# EAGLE schematic micropet_v1 (EAGLE 6.4)

## Sheet 1 of 3: I/O
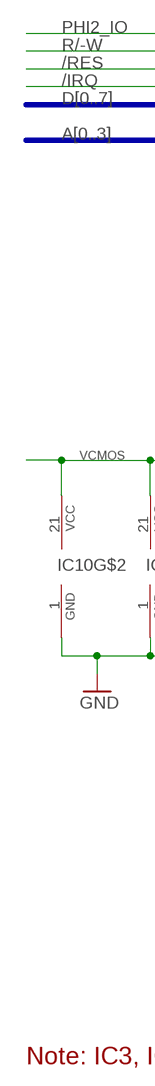
[diagram p0: schematic, sheet 1, part 1 of 2]
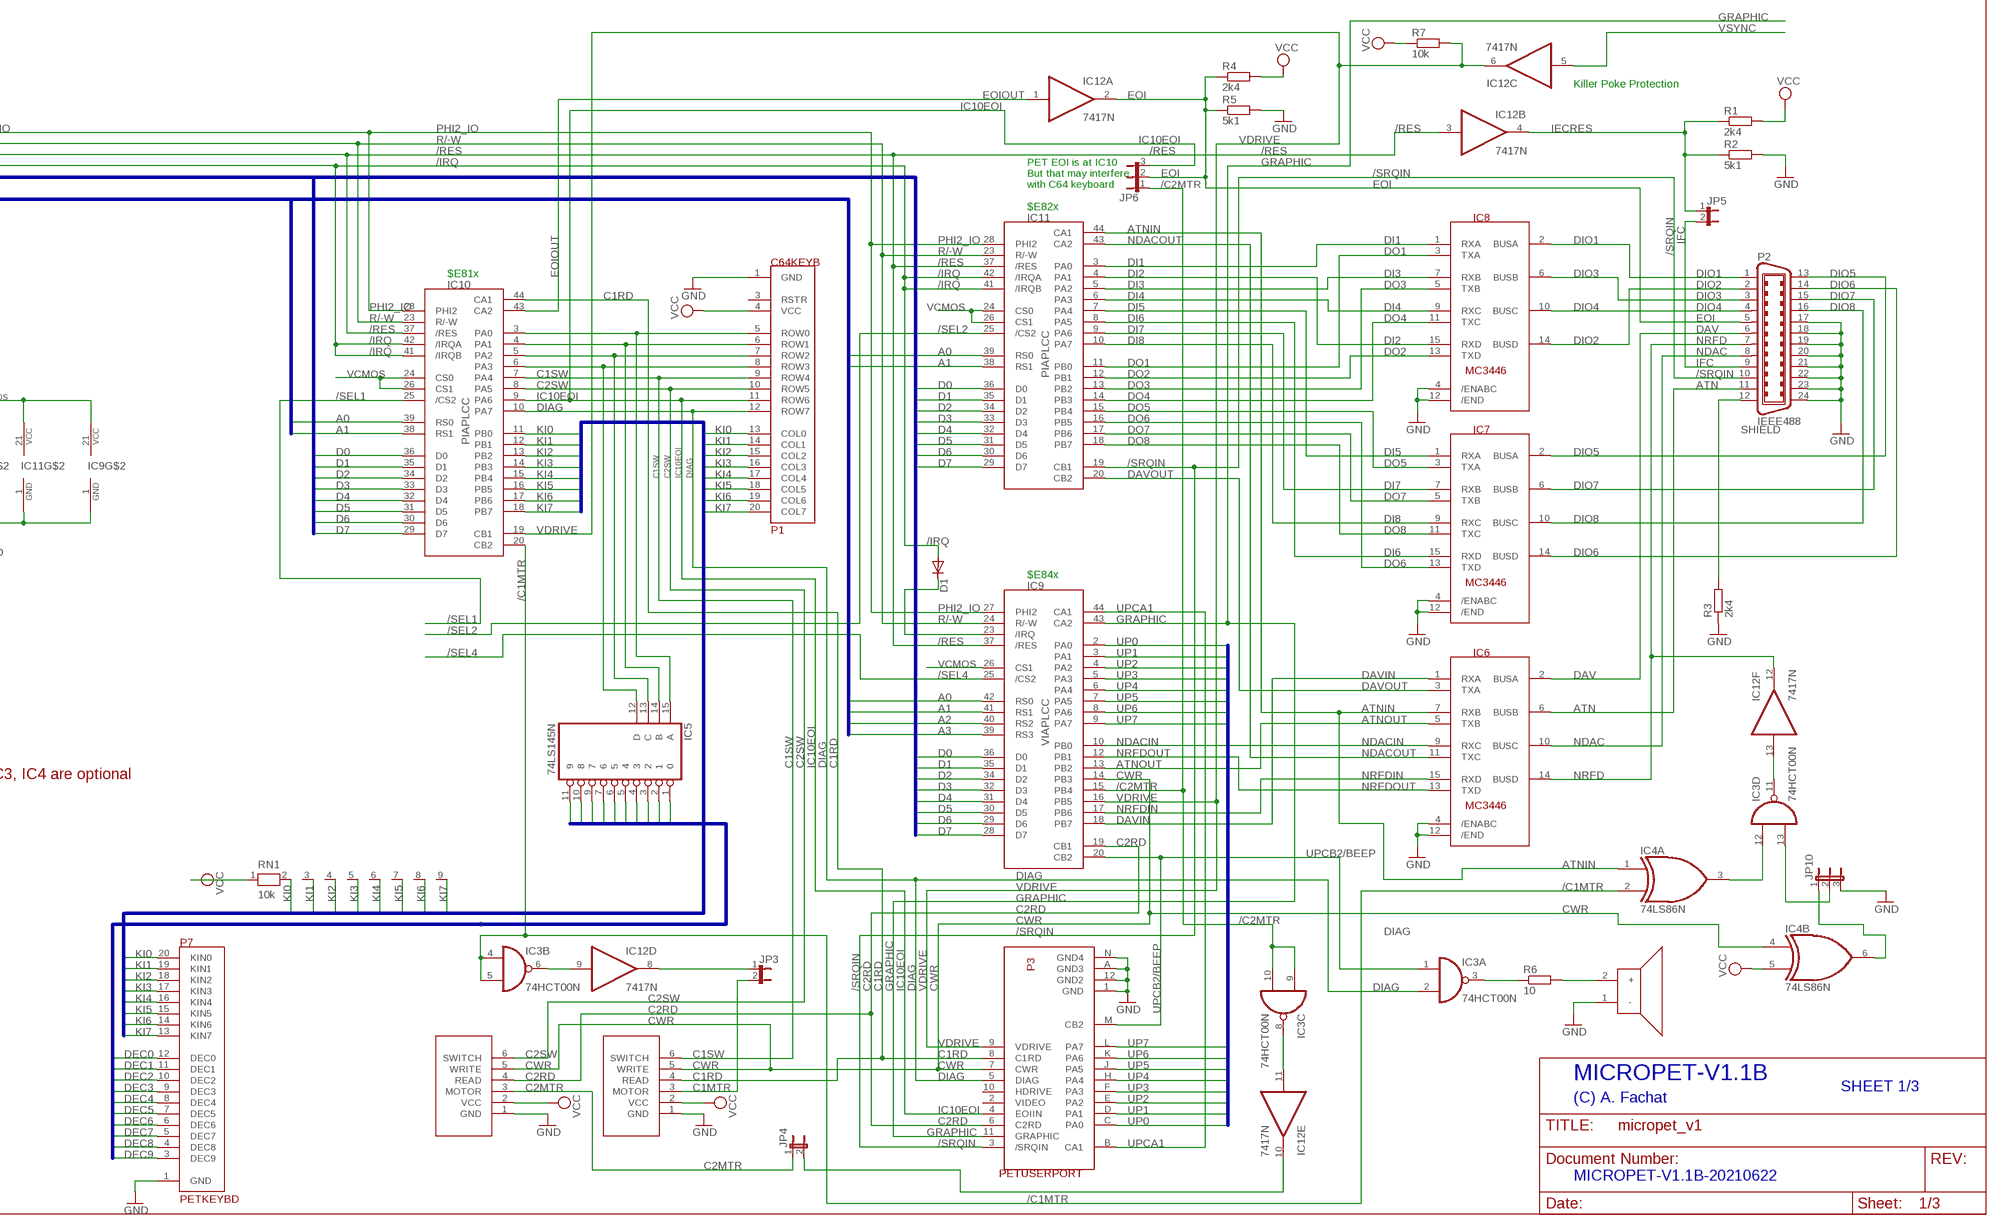
[diagram p1: schematic, sheet 1, part 2 of 2]

### Parts
BEEP1  PIEZOBEEPER  [JP2]
D1  DIODE-D-5  [D-5]
IC3  74HCT00N  [DIL14]
IC4  74LS86N  [DIL14]
IC5  74LS145N  [DIL16]
IC6  MC3446  [DIL16]
IC7  MC3446  [DIL16]
IC8  MC3446  [DIL16]
IC9  VIAPLCC  [PLCC44]
IC10  PIAPLCC  [PLCC44]
IC11  PIAPLCC  [PLCC44]
IC12  7417N  [DIL14]
JP3  JP1E  [JP1]
JP4  JP1E  [JP1]
JP5  JP1E  [JP1]
JP6  JP2E  [JP2]
JP10  JP2E  [JP2]
P1  C64KEYB  [C64KEYB]
P2  IEEE488  [24HP]
P3  PETUSERPORT  [FLAT24]
P5  CBMTAPE  [JP6]
P6  CBMTAPE  [JP6]
P7  PETKEYBD  [C64KEYB]
R1  2k4  R-EU_0207/2V  [0207/2V]
R2  5k1  R-EU_0207/2V  [0207/2V]
R3  2k4  R-EU_0207/2V  [0207/2V]
R4  2k4  R-EU_0207/10  [0207/10]
R5  5k1  R-EU_0207/2V  [0207/2V]
R6  10  R-EU_0207/2V  [0207/2V]
R7  10k  R-EU_0207/10  [0207/10]
RN1  10k  RN08  [RN-9]

### Nets
/C1MTR: IC3.4(B:I0) IC3.5(B:I1) IC4.2(A:I1) IC10.20(CB2)
/C2MTR: IC3.9(C:I0) IC3.10(C:I1) IC9.15(PB4) JP6.1
/IRQ: D1.A IC10.41(/IRQB) IC10.42(/IRQA) IC11.41(/IRQB) IC11.42(/IRQA) ; also sheet 2
/RES: IC9.37(/RES) IC10.37(/RES) IC11.37(/RES) IC12.3(B:I) ; also sheet 2,3
/SEL1: IC10.25(/CS2) ; also sheet 2
/SEL2: IC11.25(/CS2) ; also sheet 2
/SEL4: IC9.25(/CS2) ; also sheet 2
/SRQIN: IC11.19(CB1) P2.10 P3.3(/SRQIN)
A0: IC9.42(RS0) IC10.39(RS0) IC11.39(RS0) ; also sheet 2
A1: IC9.41(RS1) IC10.38(RS1) IC11.38(RS1) ; also sheet 2
A2: IC9.40(RS2) ; also sheet 2
A3: IC9.39(RS3) ; also sheet 2
ATN: IC6.6(BUSB) P2.11
ATNIN: IC4.1(A:I0) IC6.7(RXB) IC11.44(CA1)
ATNOUT: IC6.5(TXB) IC9.13(PB2)
C1MTR: JP3.2 P5.3(MOTOR)
C1RD: IC10.44(CA1) P3.8(C1RD) P5.4(READ)
C1SW: IC10.7(PA4) P1.9(ROW4) P5.6(SWITCH)
C2MTR: JP4.1 P6.3(MOTOR)
C2RD: IC9.19(CB1) P3.6(C2RD) P6.4(READ)
C2SW: IC10.8(PA5) P1.10(ROW5) P6.6(SWITCH)
CWR: IC4.4(B:I0) IC9.14(PB3) P3.7(CWR) P5.5(WRITE) P6.5(WRITE)
D0: IC9.36(D0) IC10.36(D0) IC11.36(D0) ; also sheet 2
D1: IC9.35(D1) IC10.35(D1) IC11.35(D1) ; also sheet 2
D2: IC9.34(D2) IC10.34(D2) IC11.34(D2) ; also sheet 2
D3: IC9.32(D3) IC10.33(D3) IC11.33(D3) ; also sheet 2
D4: IC9.31(D4) IC10.32(D4) IC11.32(D4) ; also sheet 2
D5: IC9.30(D5) IC10.31(D5) IC11.31(D5) ; also sheet 2
D6: IC9.29(D6) IC10.30(D6) IC11.30(D6) ; also sheet 2
D7: IC9.28(D7) IC10.29(D7) IC11.29(D7) ; also sheet 2
DAV: IC6.2(BUSA) P2.6
DAVIN: IC6.1(RXA) IC9.18(PB7)
DAVOUT: IC6.3(TXA) IC11.20(CB2)
DEC0: IC5.1 P7.12(DEC0)
DEC1: IC5.2 P7.11(DEC1)
DEC2: IC5.3 P7.10(DEC2)
DEC3: IC5.4 P7.9(DEC3)
DEC4: IC5.5 P7.8(DEC4)
DEC5: IC5.6 P7.7(DEC5)
DEC6: IC5.7 P7.6(DEC6)
DEC7: IC5.9 P7.5(DEC7)
DEC8: IC5.10 P7.4(DEC8)
DEC9: IC5.11 P7.3(DEC9)
DI1: IC8.1(RXA) IC11.3(PA0)
DI2: IC8.15(RXD) IC11.4(PA1)
DI3: IC8.7(RXB) IC11.5(PA2)
DI4: IC8.9(RXC) IC11.6(PA3)
DI5: IC7.1(RXA) IC11.7(PA4)
DI6: IC7.15(RXD) IC11.8(PA5)
DI7: IC7.7(RXB) IC11.9(PA6)
DI8: IC7.9(RXC) IC11.10(PA7)
DIAG: IC3.2(A:I1) IC10.10(PA7) P1.12(ROW7) P3.5(DIAG)
DIO1: IC8.2(BUSA) P2.1
DIO2: IC8.14(BUSD) P2.2
DIO3: IC8.6(BUSB) P2.3
DIO4: IC8.10(BUSC) P2.4
DIO5: IC7.2(BUSA) P2.13
DIO6: IC7.14(BUSD) P2.14
DIO7: IC7.6(BUSB) P2.15
DIO8: IC7.10(BUSC) P2.16
DO1: IC8.3(TXA) IC11.11(PB0)
DO2: IC8.13(TXD) IC11.12(PB1)
DO3: IC8.5(TXB) IC11.13(PB2)
DO4: IC8.11(TXC) IC11.14(PB3)
DO5: IC7.3(TXA) IC11.15(PB4)
DO6: IC7.13(TXD) IC11.16(PB5)
DO7: IC7.5(TXB) IC11.17(PB6)
DO8: IC7.11(TXC) IC11.18(PB7)
EOI: IC12.2(A:O) JP6.2 P2.5 R4.1 R5.1
EOIOUT: IC10.43(CA2) IC12.1(A:I)
GND: BEEP1.1(-) IC6.4(/ENABC) IC6.12(/END) IC7.4(/ENABC) IC7.12(/END) IC8.4(/ENABC) IC8.12(/END) IC9.1(GND) IC10.1(GND) IC11.1(GND) JP10.3 P1.1(GND) P2.17 P2.18 P2.19 P2.20 P2.21 P2.22 P2.23 P2.24 P3.1(GND) P3.12(GND2) P3.A(GND3) P3.N(GND4) P5.1(GND) P6.1(GND) P7.1(GND) R2.2 R3.1 R5.2 ; also sheet 2,3
GRAPHIC: IC9.43(CA2) P3.11(GRAPHIC) ; also sheet 2
IC10EOI: IC10.9(PA6) JP6.3 P1.11(ROW6) P3.4(EOIIN)
IECRES: IC12.4(B:O) JP5.1 R1.1 R2.1
IFC: JP5.2 P2.9
KI0: IC10.11(PB0) P1.13(COL0) P7.20(KIN0) RN1.2
KI1: IC10.12(PB1) P1.14(COL1) P7.19(KIN1) RN1.3
KI2: IC10.13(PB2) P1.15(COL2) P7.18(KIN2) RN1.4
KI3: IC10.14(PB3) P1.16(COL3) P7.17(KIN3) RN1.5
KI4: IC10.15(PB4) P1.17(COL4) P7.16(KIN4) RN1.6
KI5: IC10.16(PB5) P1.18(COL5) P7.15(KIN5) RN1.7
KI6: IC10.17(PB6) P1.19(COL6) P7.14(KIN6) RN1.8
KI7: IC10.18(PB7) P1.20(COL7) P7.13(KIN7) RN1.9
N$1: IC3.12(D:I0) IC4.3(A:O)
N$2: IC3.13(D:I1) JP10.2
N$3: IC3.3(A:O) R6.1
N$4: BEEP1.2(+) R6.2
N$5: D1.C IC9.23(/IRQ)
N$15: IC3.11(D:O) IC12.13(F:I)
N$16: IC3.6(B:O) IC12.9(D:I)
N$17: IC12.8(D:O) JP3.1
N$19: IC12.10(E:O) JP4.2
N$20: IC5.15(A) IC10.3(PA0) P1.5(ROW0)
N$21: IC5.14(B) IC10.4(PA1) P1.6(ROW1)
N$22: IC5.13(C) IC10.5(PA2) P1.7(ROW2)
N$23: IC5.12(D) IC10.6(PA3) P1.8(ROW3)
N$24: IC3.8(C:O) IC12.11(E:I)
N$27: IC4.6(B:O) JP10.1
NDAC: IC6.10(BUSC) P2.8
NDACIN: IC6.9(RXC) IC9.10(PB0)
NDACOUT: IC6.11(TXC) IC11.43(CA2)
NRFD: IC6.14(BUSD) IC12.12(F:O) P2.7
NRFDIN: IC6.15(RXD) IC9.17(PB6)
NRFDOUT: IC6.13(TXD) IC9.12(PB1)
PHI2_IO: IC9.27(PHI2) IC10.28(PHI2) IC11.28(PHI2) ; also sheet 2
R/-W: IC9.24(R/-W) IC10.23(R/-W) IC11.23(R/-W) ; also sheet 2
SHIELD: P2.12 R3.2
UP0: IC9.2(PA0) P3.C(PA0)
UP1: IC9.3(PA1) P3.D(PA1)
UP2: IC9.4(PA2) P3.E(PA2)
UP3: IC9.5(PA3) P3.F(PA3)
UP4: IC9.6(PA4) P3.H(PA4)
UP5: IC9.7(PA5) P3.J(PA5)
UP6: IC9.8(PA6) P3.K(PA6)
UP7: IC9.9(PA7) P3.L(PA7)
UPCA1: IC9.44(CA1) P3.B(CA1)
UPCB2/BEEP: IC3.1(A:I0) IC9.20(CB2) P3.M(CB2)
VCC: IC4.5(B:I1) P1.4(VCC) P5.2(VCC) P6.2(VCC) R1.2 R4.2 R7.1 RN1.1 ; also sheet 2,3
VCMOS: IC9.21(VCC) IC9.26(CS1) IC10.21(VCC) IC10.24(CS0) IC10.26(CS1) IC11.21(VCC) IC11.24(CS0) IC11.26(CS1) ; also sheet 2,3
VDRIVE: IC9.16(PB5) IC10.19(CB1) IC12.6(C:O) P3.9(VDRIVE) R7.2
VSYNC: IC12.5(C:I) ; also sheet 2,3
Unconnected: IC4.8(C:O) IC4.9(C:I0) IC4.10(C:I1) IC4.11(D:O) IC4.12(D:I0) IC4.13(D:I1) P1.3(RSTR) P3.2(VIDEO) P3.10(HDRIVE)

### Buses
D[0..7]
A[0..3]
KI[0..7]
UP[0..7]
DEC[0..9]

### Notes on the sheet
- Killer Poke Protection
- PET EOI is at IC10
  But that may interfere 
  with C64 keyboard
- $E82x
- $E81x
- $E84x
- Note: IC3, IC4 are optional
- MICROPET-V1.1B
- SHEET 1/3
- (C) A. Fachat
- MICROPET-V1.1B-20210622

## Sheet 2 of 3: RAM,ROM,CPU
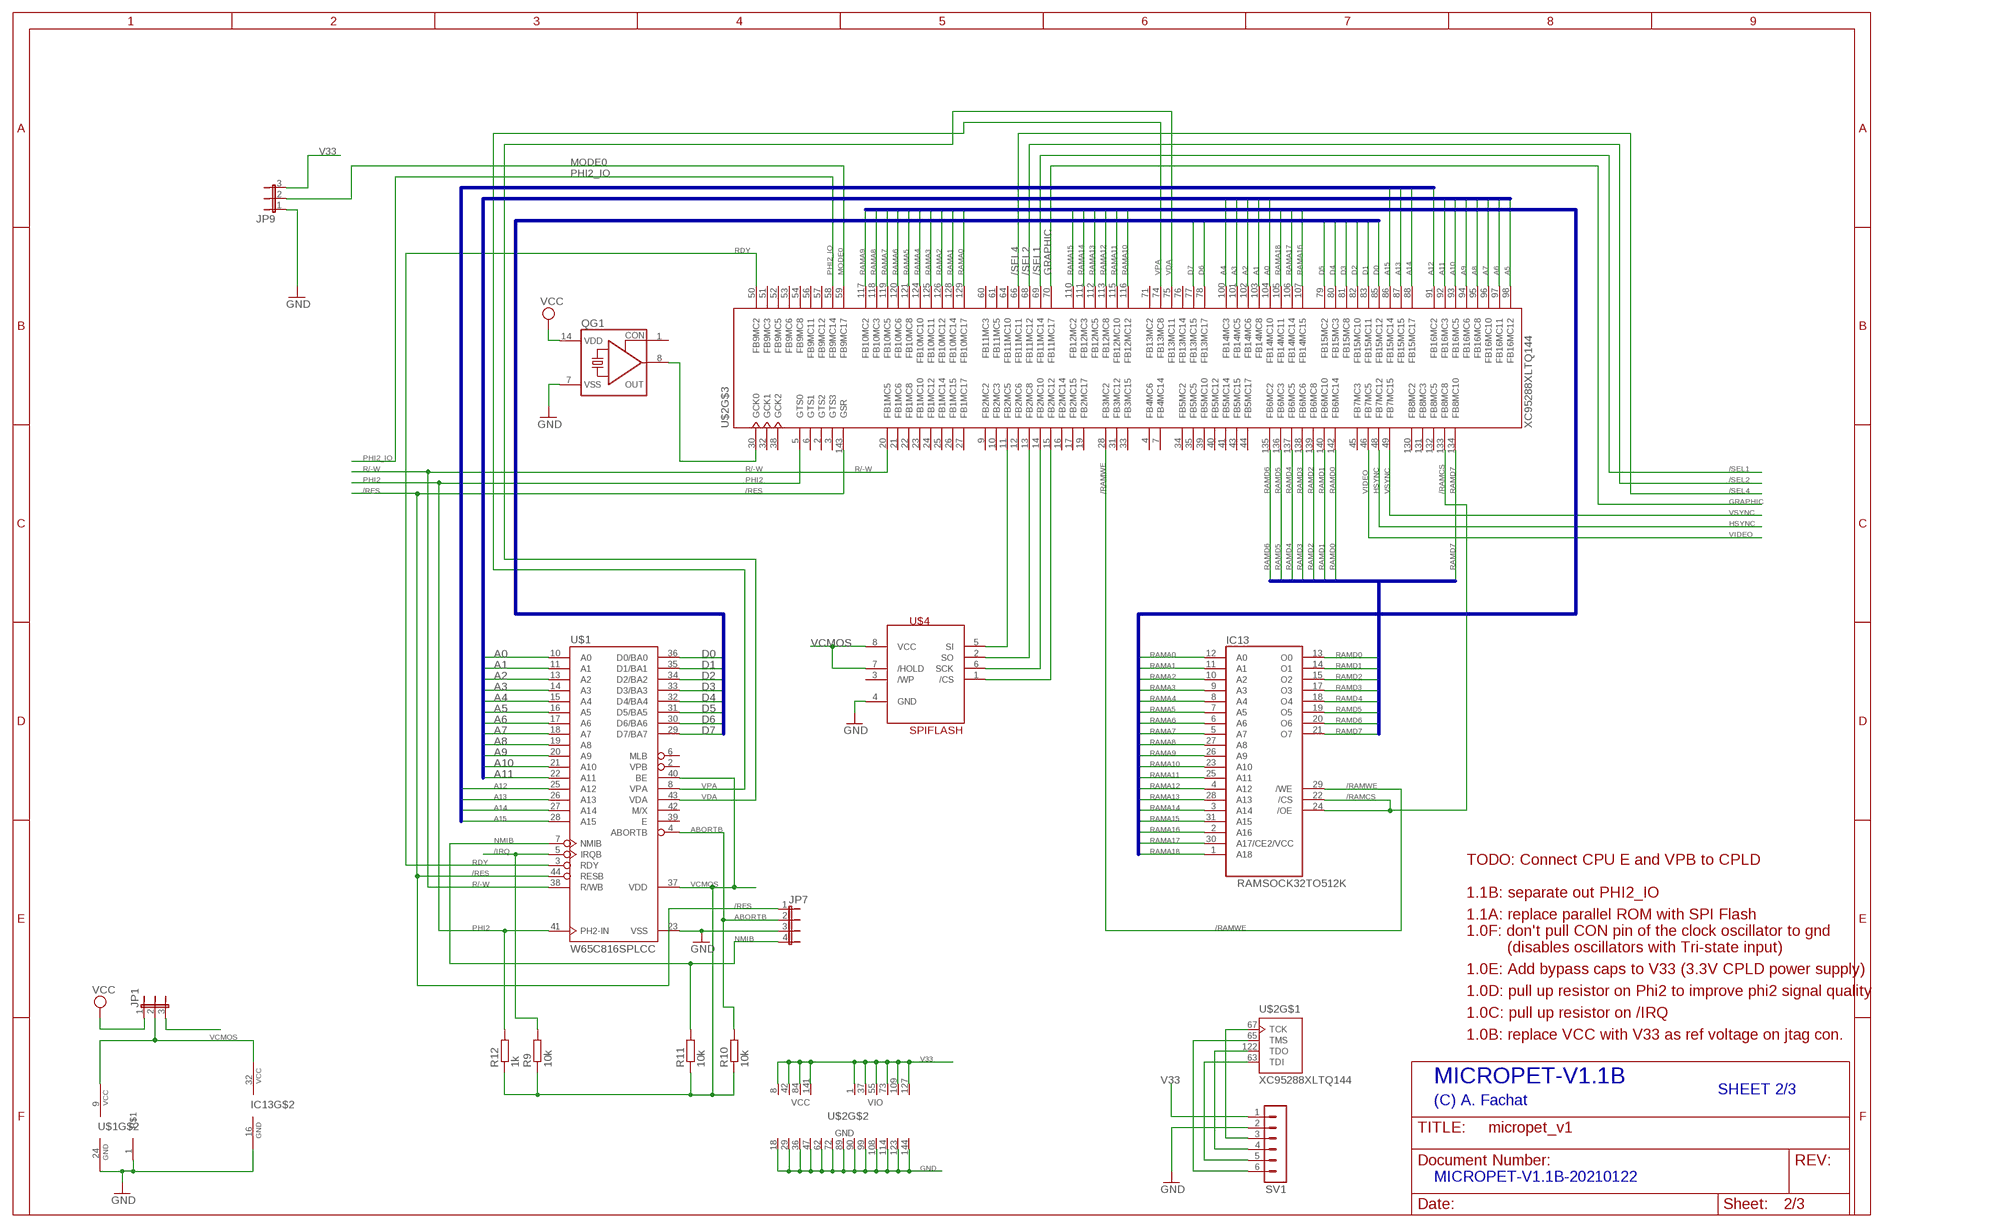
[diagram p2: schematic, sheet 2]

### Parts
IC13  RAMSOCK32TO512K  [DIL32OPT28]
JP1  JP2E  [JP2]
JP7  JP4E  [JP4]
JP9  JP2E  [JP2]
QG1  CRYSTAL_RES-SG51  [SG51]
R9  10k  R-EU_0207/2V  [0207/2V]
R10  10k  R-EU_0207/2V  [0207/2V]
R11  10k  R-EU_0207/2V  [0207/2V]
R12  1k  R-EU_0207/2V  [0207/2V]
SV1  MA06-1  [MA06-1]
U$1  W65C816SPLCC  [PLCC44]
U$2  XC95288XLTQ144  [TQFP144]
U$4  SPIFLASH  [DIL08]

### Nets
/IRQ: R9.2 U$1.5(IRQB) ; also sheet 1
/RAMCS: IC13.22(/CS) IC13.24(/OE) U$2.133(FB8MC8)
/RAMWE: IC13.29(/WE) U$2.28(FB3MC2)
/RES: JP7.1 U$1.44(RESB) U$2.143(GSR) ; also sheet 1,3
/SEL1: U$2.69(FB11MC14) ; also sheet 1
/SEL2: U$2.68(FB11MC12) ; also sheet 1
/SEL4: U$2.66(FB11MC11) ; also sheet 1
A0: U$1.10(A0) U$2.104(FB14MC10) ; also sheet 1
A1: U$1.11(A1) U$2.103(FB14MC8) ; also sheet 1
A2: U$1.13(A2) U$2.102(FB14MC6) ; also sheet 1
A3: U$1.14(A3) U$2.101(FB14MC5) ; also sheet 1
A4: U$1.15(A4) U$2.100(FB14MC3)
A5: U$1.16(A5) U$2.98(FB16MC12)
A6: U$1.17(A6) U$2.97(FB16MC11)
A7: U$1.18(A7) U$2.96(FB16MC10)
A8: U$1.19(A8) U$2.95(FB16MC8)
A9: U$1.20(A9) U$2.94(FB16MC6)
A10: U$1.21(A10) U$2.93(FB16MC5)
A11: U$1.22(A11) U$2.92(FB16MC3)
A12: U$1.25(A12) U$2.91(FB16MC2)
A13: U$1.26(A13) U$2.87(FB15MC15)
A14: U$1.27(A14) U$2.88(FB15MC17)
A15: U$1.28(A15) U$2.86(FB15MC14)
ABORTB: JP7.2 R10.2 U$1.4(ABORTB)
D0: U$1.36(D0/BA0) U$2.85(FB15MC12) ; also sheet 1
D1: U$1.35(D1/BA1) U$2.83(FB15MC11) ; also sheet 1
D2: U$1.34(D2/BA2) U$2.82(FB15MC10) ; also sheet 1
D3: U$1.33(D3/BA3) U$2.81(FB15MC8) ; also sheet 1
D4: U$1.32(D4/BA4) U$2.80(FB15MC3) ; also sheet 1
D5: U$1.31(D5/BA5) U$2.79(FB15MC2) ; also sheet 1
D6: U$1.30(D6/BA6) U$2.78(FB13MC17) ; also sheet 1
D7: U$1.29(D7/BA7) U$2.77(FB13MC15) ; also sheet 1
GND: IC13.16(GND) JP7.3 JP9.1 QG1.7(VSS) SV1.2 U$1.1 U$1.23(VSS) U$1.24(GND) U$2.18(GND) U$2.29(GND) U$2.36(GND) U$2.47(GND) U$2.62(GND) U$2.72(GND) U$2.89(GND) U$2.90(GND) U$2.99(GND) U$2.108(GND) U$2.114(GND) U$2.123(GND) U$2.144(GND) U$4.4(GND) ; also sheet 1,3
GRAPHIC: U$2.70(FB11MC17) ; also sheet 1
HSYNC: U$2.48(FB7MC12) ; also sheet 3
MODE0: JP9.2 U$2.59(FB9MC17)
N$6: QG1.8(OUT) U$2.30(GCK0)
N$11: U$2.15(FB2MC12) U$4.1(/CS)
N$12: U$2.14(FB2MC10) U$4.6(SCK)
N$13: U$2.13(FB2MC8) U$4.2(SO)
N$14: U$2.11(FB2MC5) U$4.5(SI)
NMIB: JP7.4 R11.2 U$1.7(NMIB)
PHI2: R12.2 U$1.41(PH2-IN) U$2.5(GTS0)
PHI2_IO: U$2.58(FB9MC14) ; also sheet 1
R/-W: U$1.38(R/WB) U$2.20(FB1MC5) ; also sheet 1
RAMA0: IC13.12(A0) U$2.129(FB10MC17)
RAMA1: IC13.11(A1) U$2.128(FB10MC14)
RAMA2: IC13.10(A2) U$2.126(FB10MC12)
RAMA3: IC13.9(A3) U$2.125(FB10MC11)
RAMA4: IC13.8(A4) U$2.124(FB10MC10)
RAMA5: IC13.7(A5) U$2.121(FB10MC8)
RAMA6: IC13.6(A6) U$2.120(FB10MC6)
RAMA7: IC13.5(A7) U$2.119(FB10MC5)
RAMA8: IC13.27(A8) U$2.118(FB10MC3)
RAMA9: IC13.26(A9) U$2.117(FB10MC2)
RAMA10: IC13.23(A10) U$2.116(FB12MC12)
RAMA11: IC13.25(A11) U$2.115(FB12MC10)
RAMA12: IC13.4(A12) U$2.113(FB12MC8)
RAMA13: IC13.28(A13) U$2.112(FB12MC5)
RAMA14: IC13.3(A14) U$2.111(FB12MC3)
RAMA15: IC13.31(A15) U$2.110(FB12MC2)
RAMA16: IC13.2(A16) U$2.107(FB14MC15)
RAMA17: IC13.30(A17/CE2/VCC) U$2.106(FB14MC14)
RAMA18: IC13.1(A18) U$2.105(FB14MC11)
RAMD0: IC13.13(O0) U$2.142(FB6MC14)
RAMD1: IC13.14(O1) U$2.140(FB6MC10)
RAMD2: IC13.15(O2) U$2.139(FB6MC8)
RAMD3: IC13.17(O3) U$2.138(FB6MC6)
RAMD4: IC13.18(O4) U$2.137(FB6MC5)
RAMD5: IC13.19(O5) U$2.136(FB6MC3)
RAMD6: IC13.20(O6) U$2.135(FB6MC2)
RAMD7: IC13.21(O7) U$2.134(FB8MC10)
RDY: U$1.3(RDY) U$2.50(FB9MC2)
TCK: SV1.3 U$2.67(TCK)
TDI: SV1.5 U$2.63(TDI)
TDO: SV1.4 U$2.122(TDO)
TMS: SV1.6 U$2.65(TMS)
V33: JP1.3 JP9.3 SV1.1 U$2.1(VIO) U$2.8(VCC) U$2.37(VIO) U$2.42(VCC) U$2.55(VIO) U$2.73(VIO) U$2.84(VCC) U$2.109(VIO) U$2.127(VIO) U$2.141(VCC) ; also sheet 3
VCC: JP1.1 QG1.14(VDD) ; also sheet 1,3
VCMOS: IC13.32(VCC) JP1.2 R9.1 R10.1 R11.1 R12.1 U$1.9(VCC) U$1.37(VDD) U$1.40(BE) U$4.7(/HOLD) U$4.8(VCC) ; also sheet 1,3
VDA: U$1.43(VDA) U$2.75(FB13MC11)
VIDEO: U$2.46(FB7MC5) ; also sheet 3
VPA: U$1.8(VPA) U$2.74(FB13MC8)
VSYNC: U$2.49(FB7MC15) ; also sheet 1,3
Unconnected: QG1.1(CON) U$1.2(VPB) U$1.6(MLB) U$1.39(E) U$1.42(M/X) U$2.2(GTS2) U$2.3(GTS3) U$2.4(FB4MC6) U$2.6(GTS1) U$2.7(FB4MC14) U$2.9(FB2MC2) U$2.10(FB2MC3) U$2.12(FB2MC6) U$2.16(FB2MC14) U$2.17(FB2MC15) U$2.19(FB2MC17) U$2.21(FB1MC6) U$2.22(FB1MC8) U$2.23(FB1MC10) U$2.24(FB1MC12) U$2.25(FB1MC14) U$2.26(FB1MC15) U$2.27(FB1MC17) U$2.31(FB3MC12) U$2.32(GCK1) U$2.33(FB3MC15) U$2.34(FB5MC2) U$2.35(FB5MC5) U$2.38(GCK2) U$2.39(FB5MC10) U$2.40(FB5MC12) U$2.41(FB5MC14) U$2.43(FB5MC15) U$2.44(FB5MC17) U$2.45(FB7MC3) U$2.51(FB9MC3) U$2.52(FB9MC5) U$2.53(FB9MC6) U$2.54(FB9MC8) U$2.56(FB9MC11) U$2.57(FB9MC12) U$2.60(FB11MC3) U$2.61(FB11MC5) U$2.64(FB11MC10) U$2.71(FB13MC2) U$2.76(FB13MC14) U$2.130(FB8MC2) U$2.131(FB8MC3) U$2.132(FB8MC5) U$4.3(/WP)

### Buses
A[0..11]
D[0..7]
RAMD[0..7]
RAMA[0..18]
A[12..15]

### Notes on the sheet
- TODO: Connect CPU E and VPB to CPLD
- 1.1B: separate out PHI2_IO
- 1.1A: replace parallel ROM with SPI Flash
- 1.0F: don't pull CON pin of the clock oscillator to gnd
           (disables oscillators with Tri-state input)
- 1.0E: Add bypass caps to V33 (3.3V CPLD power supply)
- 1.0D: pull up resistor on Phi2 to improve phi2 signal quality
- 1.0C: pull up resistor on /IRQ
- 1.0B: replace VCC with V33 as ref voltage on jtag con.
- MICROPET-V1.1B
- SHEET 2/3
- (C) A. Fachat
- MICROPET-V1.1B-20210122

## Sheet 3 of 3: Power
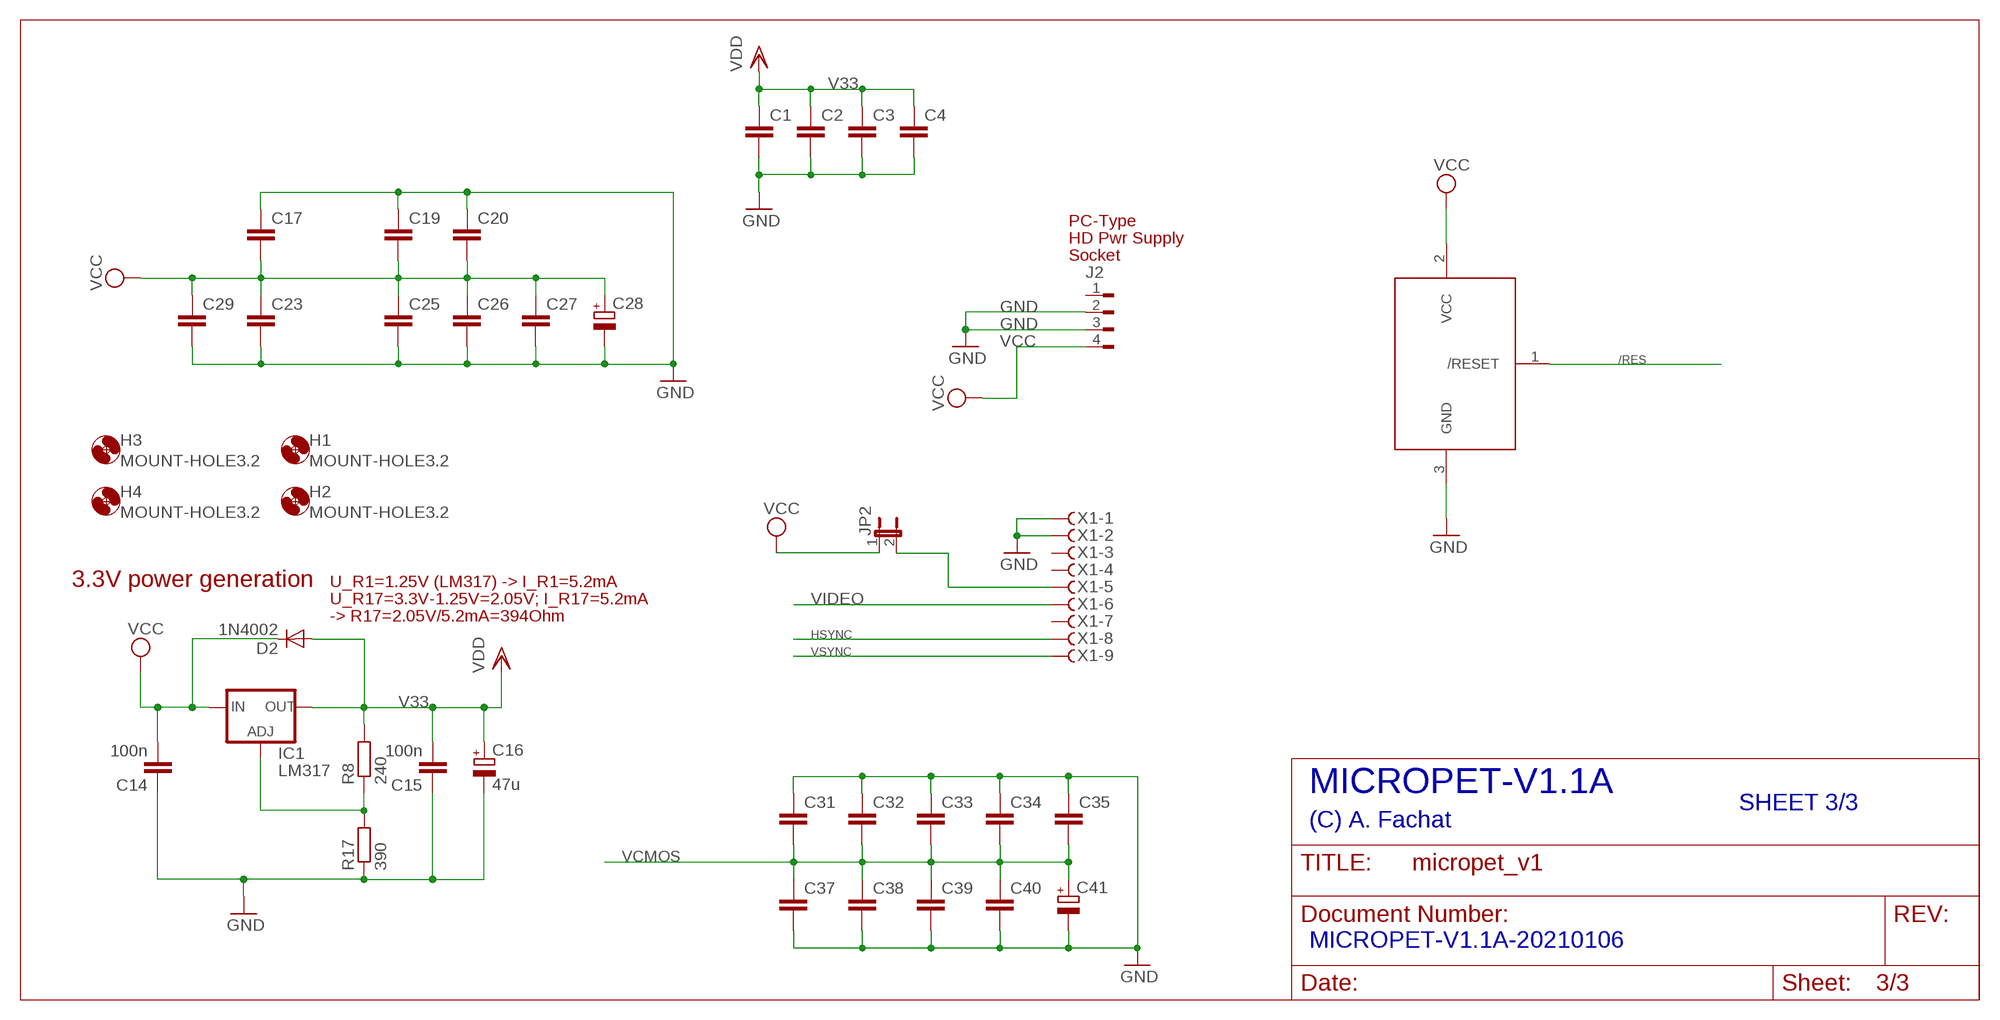
[diagram p3: schematic, sheet 3]

### Parts
C1  C-EU025-025X050  [C025-025X050]
C2  C-EU025-025X050  [C025-025X050]
C3  C-EU025-025X050  [C025-025X050]
C4  C-EU025-025X050  [C025-025X050]
C14  100n  C5/2.5  [C5B2.5]
C15  100n  C5/2.5  [C5B2.5]
C16  47u  CPOL-EUE2.5-7  [E2,5-7]
C17  C-EU025-025X050  [C025-025X050]
C19  C-EU025-025X050  [C025-025X050]
C20  C-EU025-025X050  [C025-025X050]
C23  C-EU025-025X050  [C025-025X050]
C25  C-EU025-025X050  [C025-025X050]
C26  C-EU025-025X050  [C025-025X050]
C27  C-EU025-025X050  [C025-025X050]
C28  CPOL-EUE2.5-6  [E2,5-6]
C29  C-EU025-025X050  [C025-025X050]
C31  C-EU025-025X050  [C025-025X050]
C32  C-EU025-025X050  [C025-025X050]
C33  C-EU025-025X050  [C025-025X050]
C34  C-EU025-025X050  [C025-025X050]
C35  C-EU025-025X050  [C025-025X050]
C37  C-EU025-025X050  [C025-025X050]
C38  C-EU025-025X050  [C025-025X050]
C39  C-EU025-025X050  [C025-025X050]
C40  C-EU025-025X050  [C025-025X050]
C41  CPOL-EUE2.5-6  [E2,5-6]
D2  1N4002  DIODE-C1702-05  [C1702-05]
H1  MOUNT-HOLE3.2  [3,2]
H2  MOUNT-HOLE3.2  [3,2]
H3  MOUNT-HOLE3.2  [3,2]
H4  MOUNT-HOLE3.2  [3,2]
IC1  LM317  LM317TL  [317TL]
J2  FLOP-4W827001  [827001]
JP2  JP1E  [JP1]
R8  240  R-EU_0204/5  [0204/5]
R17  390  R-EU_0204/5  [0204/5]
U$3  DS1813  [TO92]
X1  F09HPS  [F09HP]

### Nets
/RES: U$3.1(/RESET) ; also sheet 1,2
GND: C1.2 C2.2 C3.2 C4.2 C14.1 C15.1 C16.- C17.1 C19.1 C20.1 C23.2 C25.2 C26.2 C27.2 C28.- C29.2 C31.1 C32.1 C33.1 C34.1 C35.1 C37.2 C38.2 C39.2 C40.2 C41.- J2.2 J2.3 R17.1 U$3.3(GND) X1.1 X1.2 ; also sheet 1,2
HSYNC: X1.8 ; also sheet 2
N$7: IC1.1(ADJ) R8.1 R17.2
N$41: JP2.2 X1.5
V33: C1.1 C2.1 C3.1 C4.1 C15.2 C16.+ D2.A IC1.2(OUT) R8.2 ; supply symbol labelled VDD ; also sheet 2
VCC: C14.2 C17.2 C19.2 C20.2 C23.1 C25.1 C26.1 C27.1 C28.+ C29.1 D2.C IC1.3(IN) J2.4 JP2.1 U$3.2(VCC) ; also sheet 1,2
VCMOS: C31.2 C32.2 C33.2 C34.2 C35.2 C37.1 C38.1 C39.1 C40.1 C41.+ ; also sheet 1,2
VIDEO: X1.6 ; also sheet 2
VSYNC: X1.9 ; also sheet 1,2
Unconnected: J2.1 X1.3 X1.4 X1.7

### Notes on the sheet
- PC-Type
- HD Pwr Supply
- Socket
- 3.3V power generation | U_R1=1.25V (LM317) -> I_R1=5.2mA
- U_R17=3.3V-1.25V=2.05V; I_R17=5.2mA
- -> R17=2.05V/5.2mA=394Ohm
- MICROPET-V1.1A
- SHEET 3/3
- (C) A. Fachat
- MICROPET-V1.1A-20210106

## Power pins joined to a net without a drawn wire
GND: IC3.7(P:GND) IC4.7(P:GND) IC5.8(GND) IC6.8(GND) IC7.8(GND) IC8.8(GND) IC12.7(P:GND)
VCC: IC3.14(P:VCC) IC4.14(P:VCC) IC5.16(VCC) IC6.16(VCC) IC7.16(VCC) IC8.16(VCC) IC12.14(P:VCC)

## Library data of the parts
BEEP1 = csa:PIEZOBEEPER
C1-C4 C17 C19 C20 C23 C25-C27 C29 C31-C35 C37-C40 = rcl:C-EU: CAPACITOR, European symbol
C14 C15 = capacitor-wima:C: CAPACITOR naming: grid - package width
C16 C28 C41 = rcl:CPOL-EU: POLARIZED CAPACITOR, European symbol
D1 D2 = diode:DIODE-: DIODE
H1-H4 = holes:MOUNT-HOLE: MOUNTING HOLE with drill center marker
IC1 = v-reg:LM317TL: VOLTAGE REGULATOR
IC3 = 74xx-eu:74*00: Quad 2-input NAND gate
IC4 = 74xx-us:74*86: Quad 2-input EXCLUSIV-OR (XOR) gate
IC5 = 74xx-eu:74*145: BCD to decimal DECODER/DRIVER
IC6-IC8 = csa:MC3446
IC9 = csa:VIA
IC10 IC11 = csa:PIA
IC12 = 74xx-eu:74*17: Hex open collector, high-voltage
IC13 = csa:RAMSOCK32TO512K
J2 = con-amp:FLOP-4W: MATE N-LOCK Floppy / HDD conector Distributor: Bürklin 71F972
JP1 JP6 JP9 JP10 = jumper:JP2E: JUMPER
JP2-JP5 = jumper:JP1E: JUMPER
JP7 = jumper:JP4E: JUMPER
P1 = csa:C64KEYB
P2 = csa:IEEE488
P3 = csa:PETUSERPORT
P5 P6 = csa:CBMTAPE
P7 = csa:PETKEYBD
QG1 = crystal:CRYSTAL_RES-: CRYSTAL RESONATOR; OC_FARNELL: unknown; OC_NEWARK: unknown
R1-R12 R17 = rcl:R-EU_: RESISTOR, European symbol
RN1 = resistor-net:RN08: RESISTOR NETWORK
SV1 = con-lstb:MA06-1: PIN HEADER
U$1 = csa:W65C816S
U$2 = csa:XC95288XL
U$3 = csa:DS1813
U$4 = csa:SPIFLASH
X1 = con-subd:F09?S: SUB-D